# Altium schematic sheet VERSIONS.SchDoc
size A4
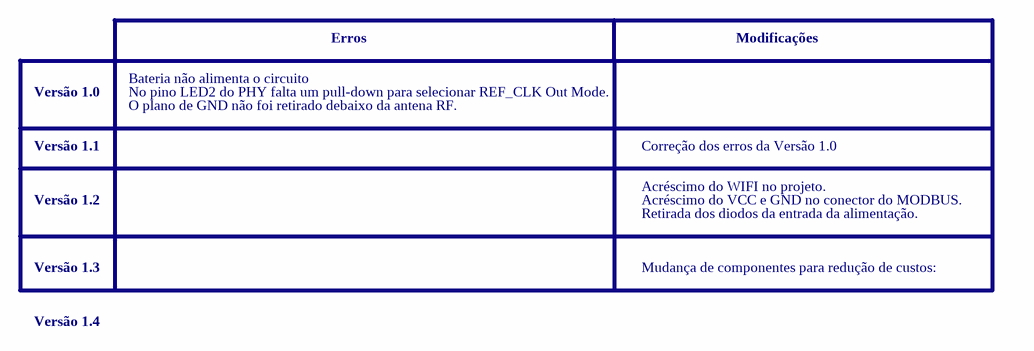
[diagram p0: VERSIONS.SchDoc]

## Parts
?  (no value)  (graphical)

## Notes on the sheet
- Versão 1.0
- Bateria não alimenta o circuito
- No pino LED2 do PHY falta um pull-down para selecionar REF_CLK Out Mode.
- Erros
- Modificações
- Versão 1.1
- O plano de GND não foi retirado debaixo da antena RF.
- Correção dos erros da Versão 1.0
- Versão 1.2
- Acréscimo do WIFI no projeto.
- Acréscimo do VCC e GND no conector do MODBUS.
- Retirada dos diodos da entrada da alimentação.
- Versão 1.3
- Mudança de componentes para redução de custos:
- Versão 1.4
- Project:
- Title:
- Rev.
- Size
- Sheet
- Date
- /
- R. Francisca Resende Merciai
  Nº 90
  Barão Geraldo
  13084-195 Campinas SP Brasil

## Library data of the parts
? = Title_Block3